# EAGLE design ELFKIN_TEST_B (EAGLE 7.7.0)
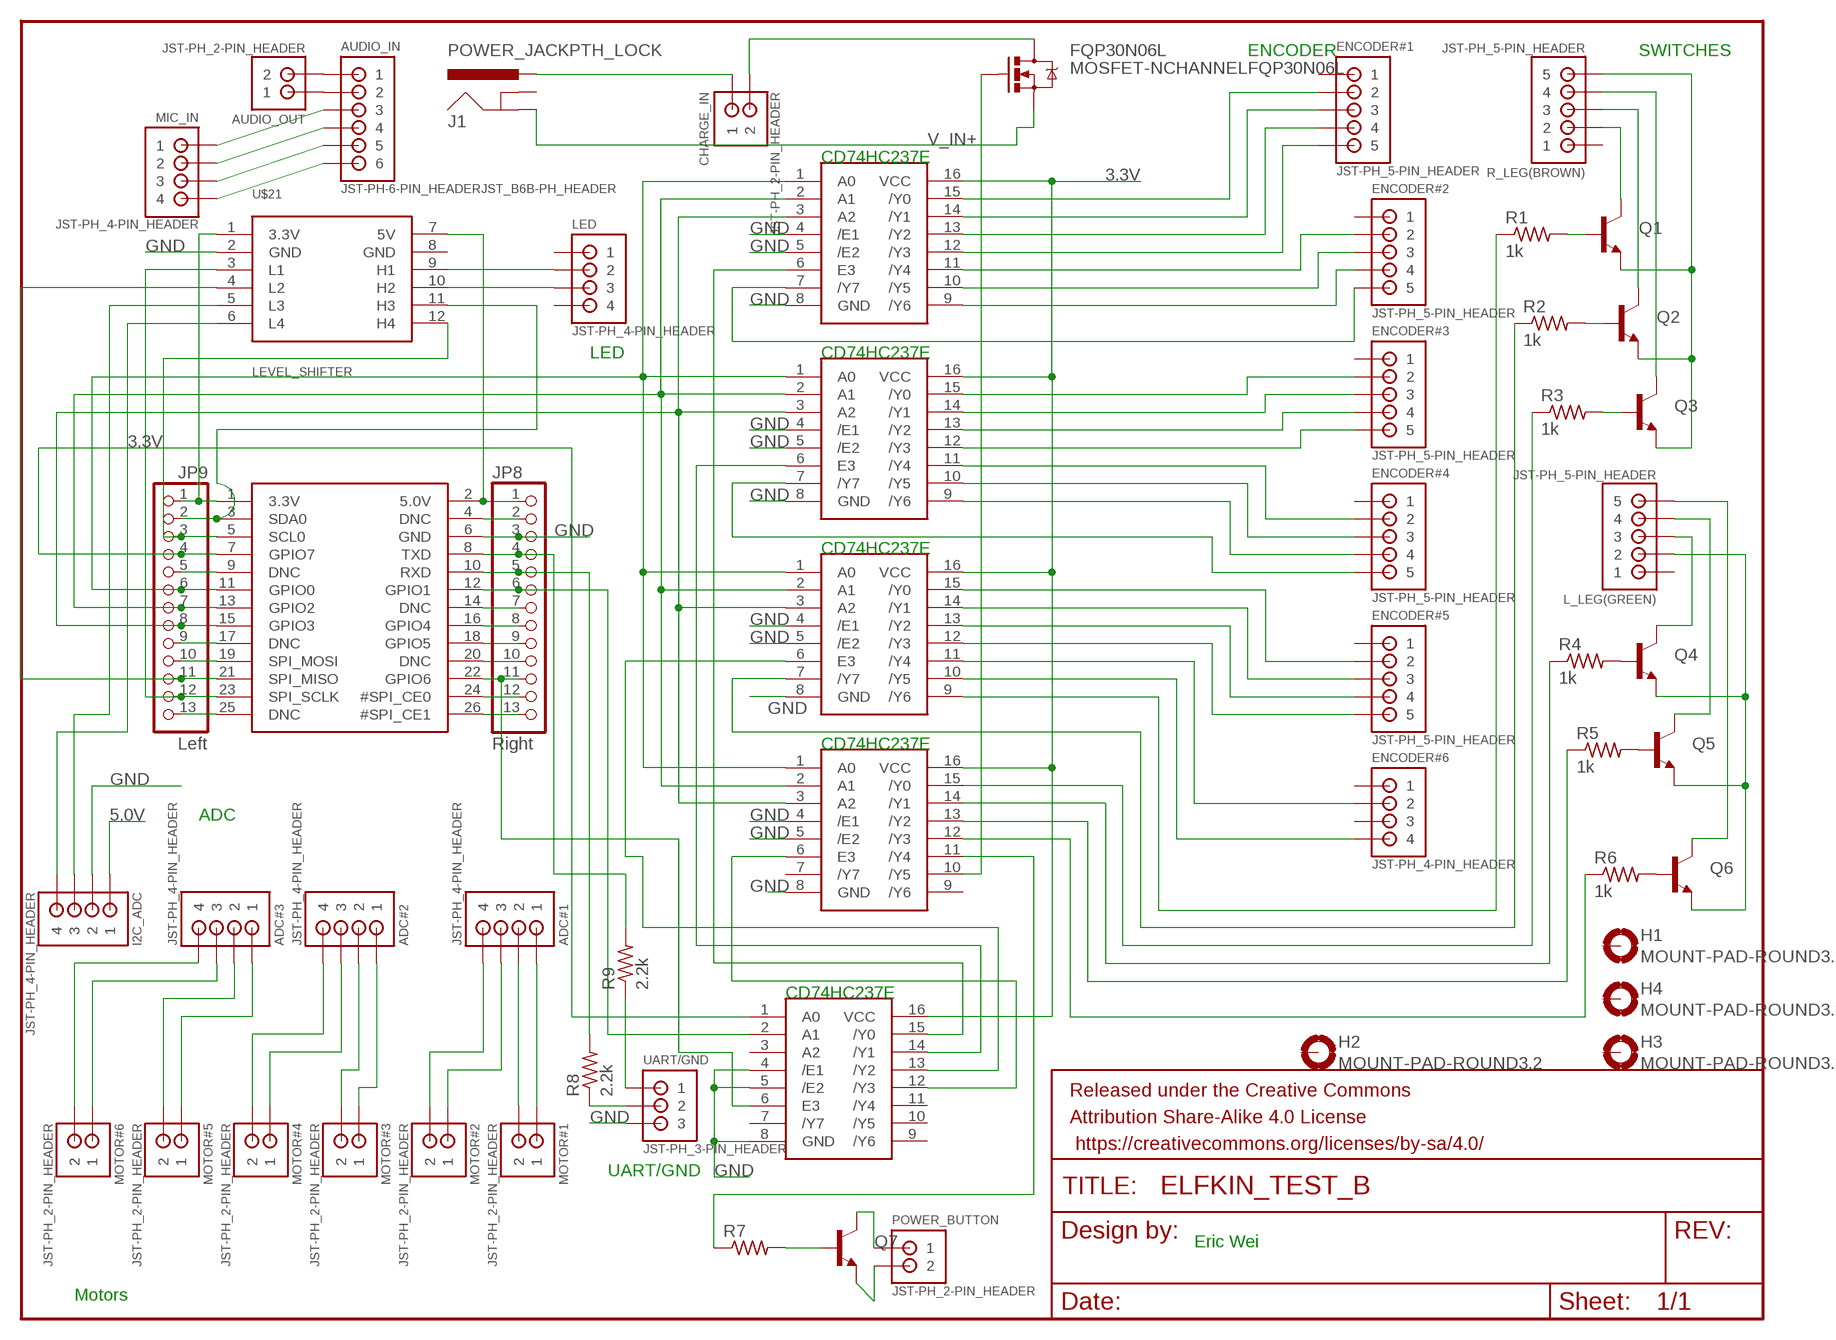
[diagram p0: schematic, sheet 1]

## Parts
ADC#1  JST-PH_4-PIN_HEADER  [JST_B4B-PH_HEADER]
ADC#2  JST-PH_4-PIN_HEADER  [JST_B4B-PH_HEADER]
ADC#3  JST-PH_4-PIN_HEADER  [JST_B4B-PH_HEADER]
AUDIO_IN  JST-PH-6-PIN_HEADERJST_B6B-PH_HEADER  [JST_B6B-PH_HEADER]
AUDIO_OUT  JST-PH_2-PIN_HEADER  [JST_B2B-PH_HEADER]
CHARGE_IN  JST-PH_2-PIN_HEADER  [JST_B2B-PH_HEADER]
ENCODER#1  JST-PH_5-PIN_HEADER  [JST_B5B-PH_HEADER]
ENCODER#2  JST-PH_5-PIN_HEADER  [JST_B5B-PH_HEADER]
ENCODER#3  JST-PH_5-PIN_HEADER  [JST_B5B-PH_HEADER]
ENCODER#4  JST-PH_5-PIN_HEADER  [JST_B5B-PH_HEADER]
ENCODER#5  JST-PH_5-PIN_HEADER  [JST_B5B-PH_HEADER]
ENCODER#6  JST-PH_4-PIN_HEADER  [JST_B4B-PH_HEADER]
FQP30N06L  MOSFET-NCHANNELFQP30N06L  [TO220V]
FRAME1  FRAME-LETTER  [CREATIVE_COMMONS]
H1  MOUNT-PAD-ROUND3.2  [3,2-PAD]
H2  MOUNT-PAD-ROUND3.2  [3,2-PAD]
H3  MOUNT-PAD-ROUND3.2  [3,2-PAD]
H4  MOUNT-PAD-ROUND3.2  [3,2-PAD]
I2C_ADC  JST-PH_4-PIN_HEADER  [JST_B4B-PH_HEADER]
J1  POWER_JACKPTH_LOCK  [POWER_JACK_PTH_LOCK]
JP7  PI  RASBERRYPI_IDC  [RASBERRYPI_IDC]
JP8  Right  HEADER-1X1380MIL  [1X13_ROUND_76MIL]
JP9  Left  HEADER-1X1380MIL  [1X13_ROUND_76MIL]
L_LEG(GREEN)  JST-PH_5-PIN_HEADER  [JST_B5B-PH_HEADER]
LED  JST-PH_4-PIN_HEADER  [JST_B4B-PH_HEADER]
MIC_IN  JST-PH_4-PIN_HEADER  [JST_B4B-PH_HEADER]
MOTOR#1  JST-PH_2-PIN_HEADER  [JST_B2B-PH_HEADER]
MOTOR#2  JST-PH_2-PIN_HEADER  [JST_B2B-PH_HEADER]
MOTOR#3  JST-PH_2-PIN_HEADER  [JST_B2B-PH_HEADER]
MOTOR#4  JST-PH_2-PIN_HEADER  [JST_B2B-PH_HEADER]
MOTOR#5  JST-PH_2-PIN_HEADER  [JST_B2B-PH_HEADER]
MOTOR#6  JST-PH_2-PIN_HEADER  [JST_B2B-PH_HEADER]
POWER_BUTTON  JST-PH_2-PIN_HEADER  [JST_B2B-PH_HEADER]
Q1  TRANSISTOR_NPN2N3904  [TO-92]
Q2  TRANSISTOR_NPN2N3904  [TO-92]
Q3  TRANSISTOR_NPN2N3904  [TO-92]
Q4  TRANSISTOR_NPN2N3904  [TO-92]
Q5  TRANSISTOR_NPN2N3904  [TO-92]
Q6  TRANSISTOR_NPN2N3904  [TO-92]
Q7  TRANSISTOR_NPN2N3904  [TO-92]
R1  1k  R-US_0207/5V  [0207/5V]
R2  1k  R-US_0207/5V  [0207/5V]
R3  1k  R-US_0207/5V  [0207/5V]
R4  1k  R-US_0207/5V  [0207/5V]
R5  1k  R-US_0207/5V  [0207/5V]
R6  1k  R-US_0207/5V  [0207/5V]
R7  R-US_0207/5V  [0207/5V]
R8  2.2k  R-US_0207/5V  [0207/5V]
R9  2.2k  R-US_0207/5V  [0207/5V]
R_LEG(BROWN)  JST-PH_5-PIN_HEADER  [JST_B5B-PH_HEADER]
U$1  74LVC138ADDIL16  [DIL16]
U$2  74LVC138ADDIL16  [DIL16]
U$3  74LVC138ADDIL16  [DIL16]
U$4  74LVC138ADDIL16  [DIL16]
U$5  74LVC138ADDIL16  [DIL16]
U$21  LEVEL_SHIFTER  [LEVEL_SHIFTER]
UART/GND  JST-PH_3-PIN_HEADER  [JST_B3B-PH_HEADER]

## Nets
3.3V: JP7.1(3.3V) JP9.1 U$1.16(VCC) U$2.16(VCC) U$3.16(VCC) U$4.16(VCC) U$5.16(VCC) U$21.1(3.3V)
5.0V: I2C_ADC.P1 JP7.2(5.0V) JP8.1 U$21.7(5V)
GND: I2C_ADC.P2 JP7.6(GND) JP8.3 U$1.4(/E1) U$1.5(/E2) U$1.8(GND) U$2.4(/E1) U$2.5(/E2) U$2.8(GND) U$3.4(/E1) U$3.5(/E2) U$3.8(GND) U$4.4(/E1) U$4.5(/E2) U$4.8(GND) U$5.4(/E1) U$5.5(/E2) U$5.8(GND) U$21.2(GND) UART/GND.P3
N$1: JP7.11(GPIO0) JP9.6 U$1.1(A0) U$2.1(A0) U$3.1(A0) U$4.1(A0)
N$2: JP7.13(GPIO2) JP9.7 U$1.2(A1) U$2.2(A1) U$3.2(A1) U$4.2(A1)
N$3: JP7.15(GPIO3) JP9.8 U$1.3(A2) U$2.3(A2) U$3.3(A2) U$4.3(A2)
N$4: ENCODER#1.P2 U$1.15(/Y0)
N$5: ENCODER#1.P3 U$1.14(/Y1)
N$6: ENCODER#1.P4 U$1.13(/Y2)
N$7: ENCODER#1.P5 U$1.12(/Y3)
N$8: ENCODER#2.P2 U$1.11(/Y4)
N$9: ENCODER#2.P3 U$1.10(/Y5)
N$10: ENCODER#2.P4 U$1.9(/Y6)
N$11: ENCODER#2.P5 U$1.7(/Y7)
N$12: ENCODER#3.P2 U$2.15(/Y0)
N$13: ENCODER#3.P3 U$2.14(/Y1)
N$14: ENCODER#3.P4 U$2.13(/Y2)
N$15: ENCODER#3.P5 U$2.12(/Y3)
N$16: ENCODER#4.P2 U$2.11(/Y4)
N$17: ENCODER#4.P3 U$2.10(/Y5)
N$18: ENCODER#4.P4 U$2.9(/Y6)
N$19: ENCODER#4.P5 U$2.7(/Y7)
N$20: ENCODER#5.P2 U$3.15(/Y0)
N$21: ENCODER#5.P3 U$3.14(/Y1)
N$22: ENCODER#5.P4 U$3.13(/Y2)
N$23: ENCODER#5.P5 U$3.12(/Y3)
N$24: ENCODER#6.P2 U$3.11(/Y4)
N$25: ENCODER#6.P4 U$3.10(/Y5)
N$26: R2.1 U$3.7(/Y7)
N$27: ADC#1.P1 MOTOR#1.P1
N$28: ADC#1.P2 MOTOR#1.P2
N$29: ADC#1.P3 MOTOR#2.P1
N$30: ADC#1.P4 MOTOR#2.P2
N$31: ADC#2.P1 MOTOR#3.P1
N$32: ADC#2.P2 MOTOR#3.P2
N$33: ADC#2.P3 MOTOR#4.P1
N$34: ADC#2.P4 MOTOR#4.P2
N$35: ADC#3.P1 MOTOR#5.P1
N$36: ADC#3.P2 MOTOR#5.P2
N$37: ADC#3.P3 MOTOR#6.P1
N$38: ADC#3.P4 MOTOR#6.P2
N$39: Q1.2(B) R1.2
N$40: Q3.2(B) R3.2
N$41: Q2.2(B) R2.2
N$42: Q4.2(B) R4.2
N$43: Q5.2(B) R5.2
N$44: Q6.2(B) R6.2
N$45: R1.1 U$3.9(/Y6)
N$46: R3.1 U$4.15(/Y0)
N$47: R4.1 U$4.14(/Y1)
N$48: R5.1 U$4.13(/Y2)
N$49: Q1.1(E) Q2.1(E) Q3.1(E) R_LEG(BROWN).P5
N$50: R6.1 U$4.12(/Y3)
N$51: AUDIO_IN.P3 MIC_IN.P1
N$52: I2C_ADC.P4 U$21.6(L4)
N$53: JP7.7(GPIO7) JP9.4 U$5.1(A0)
N$54: JP7.9(DNC) JP9.5
N$55: L_LEG(GREEN).P2 Q4.1(E) Q5.1(E) Q6.1(E)
N$56: L_LEG(GREEN).P3 Q4.3(C)
N$57: Q1.3(C) R_LEG(BROWN).P2
N$58: JP7.17(DNC) JP9.9
N$59: JP7.19(SPI_MOSI) JP9.10
N$60: JP7.18(GPIO5) JP8.9
N$61: JP7.23(SPI_SCLK) JP9.12 U$21.3(L1)
N$62: JP7.25(DNC) JP9.13
N$63: JP7.4(DNC) JP8.2
N$64: Q2.3(C) R_LEG(BROWN).P3
N$65: JP7.10(RXD) JP8.5 R8.2
N$66: JP7.12(GPIO1) JP8.6 U$5.2(A1)
N$67: JP7.14(DNC) JP8.7
N$68: JP7.16(GPIO4) JP8.8
N$70: JP7.20(DNC) JP8.10
N$71: JP7.22(GPIO6) JP8.11 U$5.6(E3)
N$72: JP7.24(#SPI_CE0) JP8.12
N$73: JP7.26(#SPI_CE1) JP8.13
N$74: L_LEG(GREEN).P4 Q5.3(C)
N$75: L_LEG(GREEN).P5 Q6.3(C)
N$76: I2C_ADC.P3 U$21.5(L3)
N$77: AUDIO_IN.P4 MIC_IN.P2
N$78: Q7.2(B) R7.2
N$79: POWER_BUTTON.P1 Q7.3(C)
N$80: POWER_BUTTON.P2 Q7.1(E)
N$81: R7.1 U$4.11(/Y4)
N$83: CHARGE_IN.P1 J1.PWR
N$84: FQP30N06L.1(G) U$4.10(/Y5)
N$85: AUDIO_IN.P2 AUDIO_OUT.P1
N$86: AUDIO_IN.P1 AUDIO_OUT.P2
N$87: U$1.6(E3) U$5.15(/Y0)
N$88: U$2.6(E3) U$5.14(/Y1)
N$89: U$3.6(E3) U$5.13(/Y2)
N$90: Q3.3(C) R_LEG(BROWN).P4
N$91: U$4.6(E3) U$5.12(/Y3)
N$92: JP7.8(TXD) JP8.4 R9.2
N$93: AUDIO_IN.P5 MIC_IN.P3
N$94: AUDIO_IN.P6 MIC_IN.P4
N$95: LED.P2 U$21.9(H1)
N$96: LED.P3 U$21.10(H2)
N$97: R8.1 UART/GND.P2
N$98: R9.1 UART/GND.P1
N$99: CHARGE_IN.P2 FQP30N06L.2(D)
N$100: JP7.21(SPI_MISO) JP9.11 U$21.4(L2)
N$101: JP7.5(SCL0) JP9.3 U$21.12(H4)
N$103: JP7.3(SDA0) JP9.2 U$21.11(H3)
V_IN+: FQP30N06L.3(S) J1.GND
Unconnected: ENCODER#1.P1 ENCODER#2.P1 ENCODER#3.P1 ENCODER#4.P1 ENCODER#5.P1 ENCODER#6.P1 ENCODER#6.P3 H1.B3,2(MOUNT) H2.B3,2(MOUNT) H3.B3,2(MOUNT) H4.B3,2(MOUNT) J1.GNDBREAK L_LEG(GREEN).P1 LED.P1 LED.P4 R_LEG(BROWN).P1 U$4.7(/Y7) U$4.9(/Y6) U$5.3(A2) U$5.7(/Y7) U$5.9(/Y6) U$5.10(/Y5) U$5.11(/Y4)

## Notes on the sheet
- ENCODER | SWITCHES
- CD74HC237E
- LED | CD74HC237E
- CD74HC237E
- CD74HC237E
- ADC
- CD74HC237E
- UART/GND
- Eric Wei
- Motors

## Power pins joined to a net without a drawn wire
GND: U$21.8(GND)

## Library data of the parts
ADC#1-ADC#3 ENCODER#6 I2C_ADC LED MIC_IN = SRG:JST-PH_4-PIN_HEADER: 4-pin JST PH Shrouded Header, top entry P/N B4B-PH-K-S Mating connector PHR-4 Mating cable assembly: Sparkfun PRT-09916 <http://www.sparkfun.com/products/9916>
AUDIO_IN = JST_Connectors:JST-PH-6-PIN_HEADER: 6-PIN JST PH Shrouded Header
AUDIO_OUT CHARGE_IN MOTOR#1-MOTOR#6 POWER_BUTTON = SRG:JST-PH_2-PIN_HEADER: 2-pin JST PH Shrouded Header, top entry P/N B2B-PH-K-S Mating connector PHR-2 Mating cable assembly: Sparkfun PRT-09914 <http://www.sparkfun.com/products/9914>
ENCODER#1-ENCODER#5 L_LEG(GREEN) R_LEG(BROWN) = SRG:JST-PH_5-PIN_HEADER: 5-pin JST PH Shrouded Header, top entry P/N B5B-PH-K-S Mating connector PHR-5 Mating cable assembly: Sparkfun PRT-09917 <http://www.sparkfun.com/products/9917>
FQP30N06L = SparkFun-DiscreteSemi:MOSFET-NCHANNEL: Common NMOSFET Parts MFG P/N Store ID Prod ID FDD8780 TRANS-09984 SI7820DN TRANS-11055 FDS6630A IC-08089 2N7002PW TRANS-11151 FQP30N06L COM-10213 TRANS-10060 BSS123LT1G TRANS-08345 BSS138 TRANS-00830 BS170 2N7000; PROD_ID: TRANS-10060
FRAME1 = SparkFun-Aesthetics:FRAME-LETTER: Schematic Frame Standard 8.5x11 US Letter frame
H1-H4 = holes:MOUNT-PAD-ROUND: MOUNTING PAD, round
J1 = SparkFun-Connectors:POWER_JACK: Power Jack This is the standard 5.5mm barrel jack for power. The PTH is the most common, proven, reliable, footprint. The Slot footprint only works if the mill layer is transmitted to the PCB fab house so be warned. Mating wall wart : TOL-00298 (and others); PROD_ID: CONN-08197; SF_ID: PRT-00119
JP7 = microbuilder:RASBERRYPI_IDC: Rasberry PI IDC Header
JP8 JP9 = microbuilder:HEADER-1X13
Q1-Q7 = SparkFun-DiscreteSemi:TRANSISTOR_NPN: Generic NPN BJT MMBT2222A - TRANS-08049 (SOT-23, 1A 40V) MPSA42 - TRANS-09116 (SOT-23, 500mA 300V) MMBT5088LT1G - TRANS-11160 (SOT-23, 50 mA 30V) BC547 - COM-08928 <http://www.sparkfun.com/products/8928> (TO-92 45V 100mA) (1.Collector 2.Base 3.Emitter) 2N3904 - COM-00521 <http://www.sparkfun.com/products/521> (TO-92 40V 200mA) (1.Emitter 2.Base 3.Collector) P2N2222A - COM-12852 <http://www.sparkfun.com/products/12852> (TO-92 40V 600mA) (1.Collector 2.Base 3.Emitter); PROD_ID: TRANS-08447
R1-R9 = resistor:R-US_: RESISTOR, American symbol
U$1-U$5 = SparkFun-DigitalIC:74LVC138AD: 3-to-8 decoder
U$21 = SparkFun-Connectors:LEVEL_SHIFTER
UART/GND = SRG:JST-PH_3-PIN_HEADER: 3-pin JST PH Shrouded Header, top entry P/N B3B-PH-K-S Mating connector PHR-3

## Net classes
0 default: clearance 0.205 mm

## Board
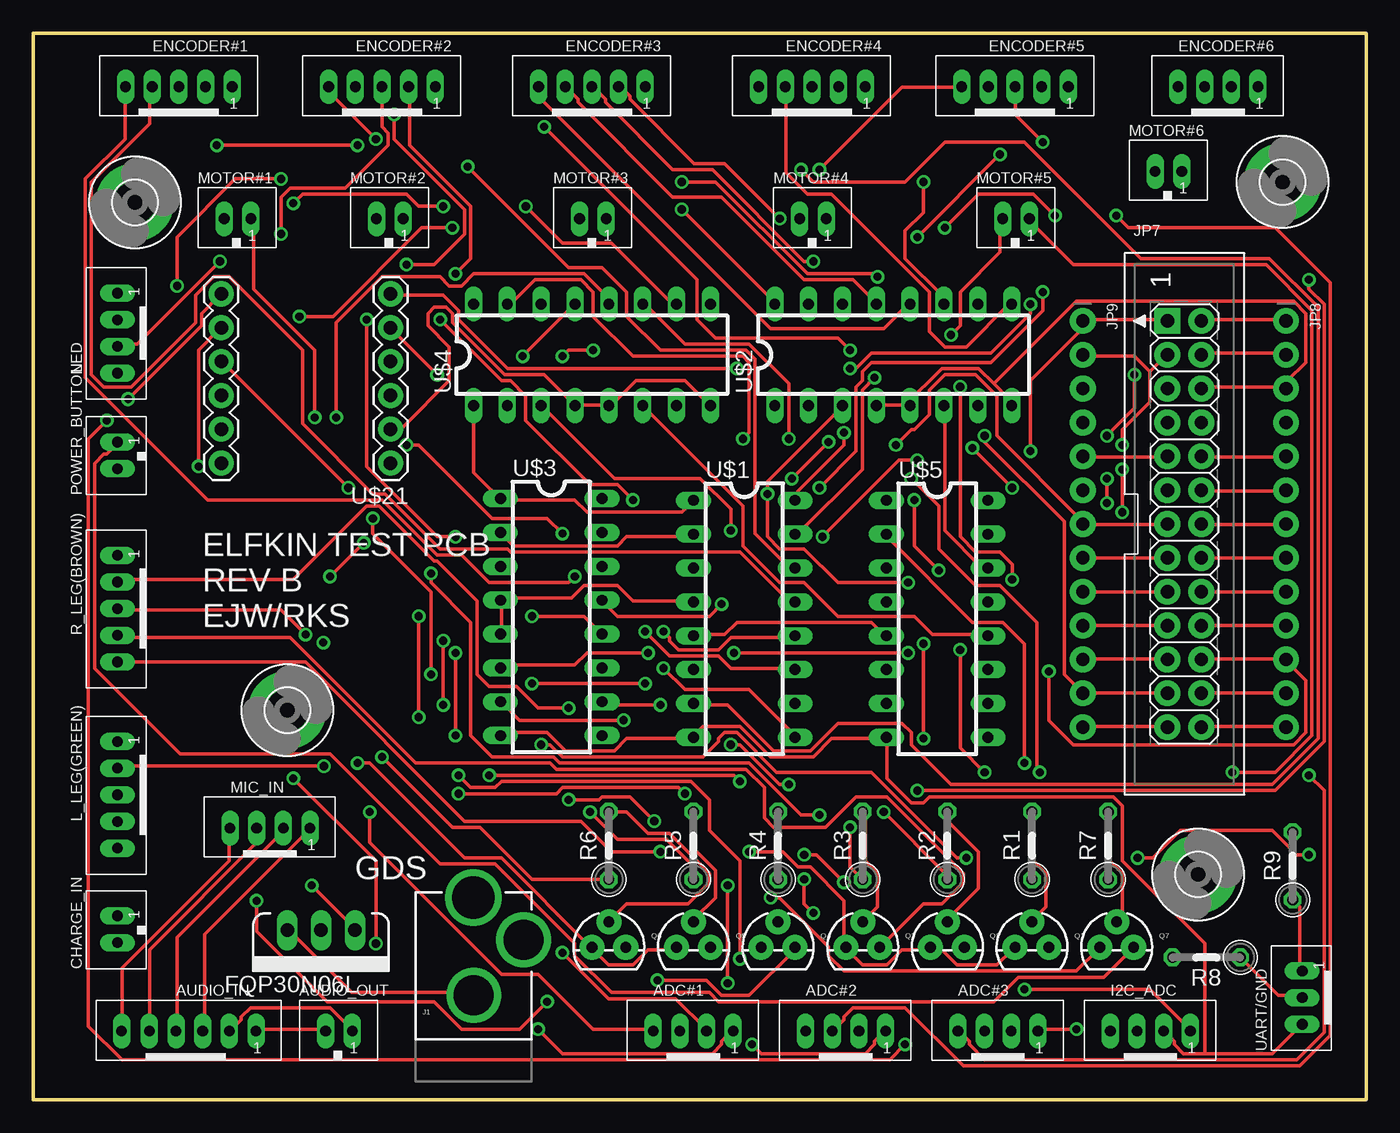
[diagram p1: board, top side]
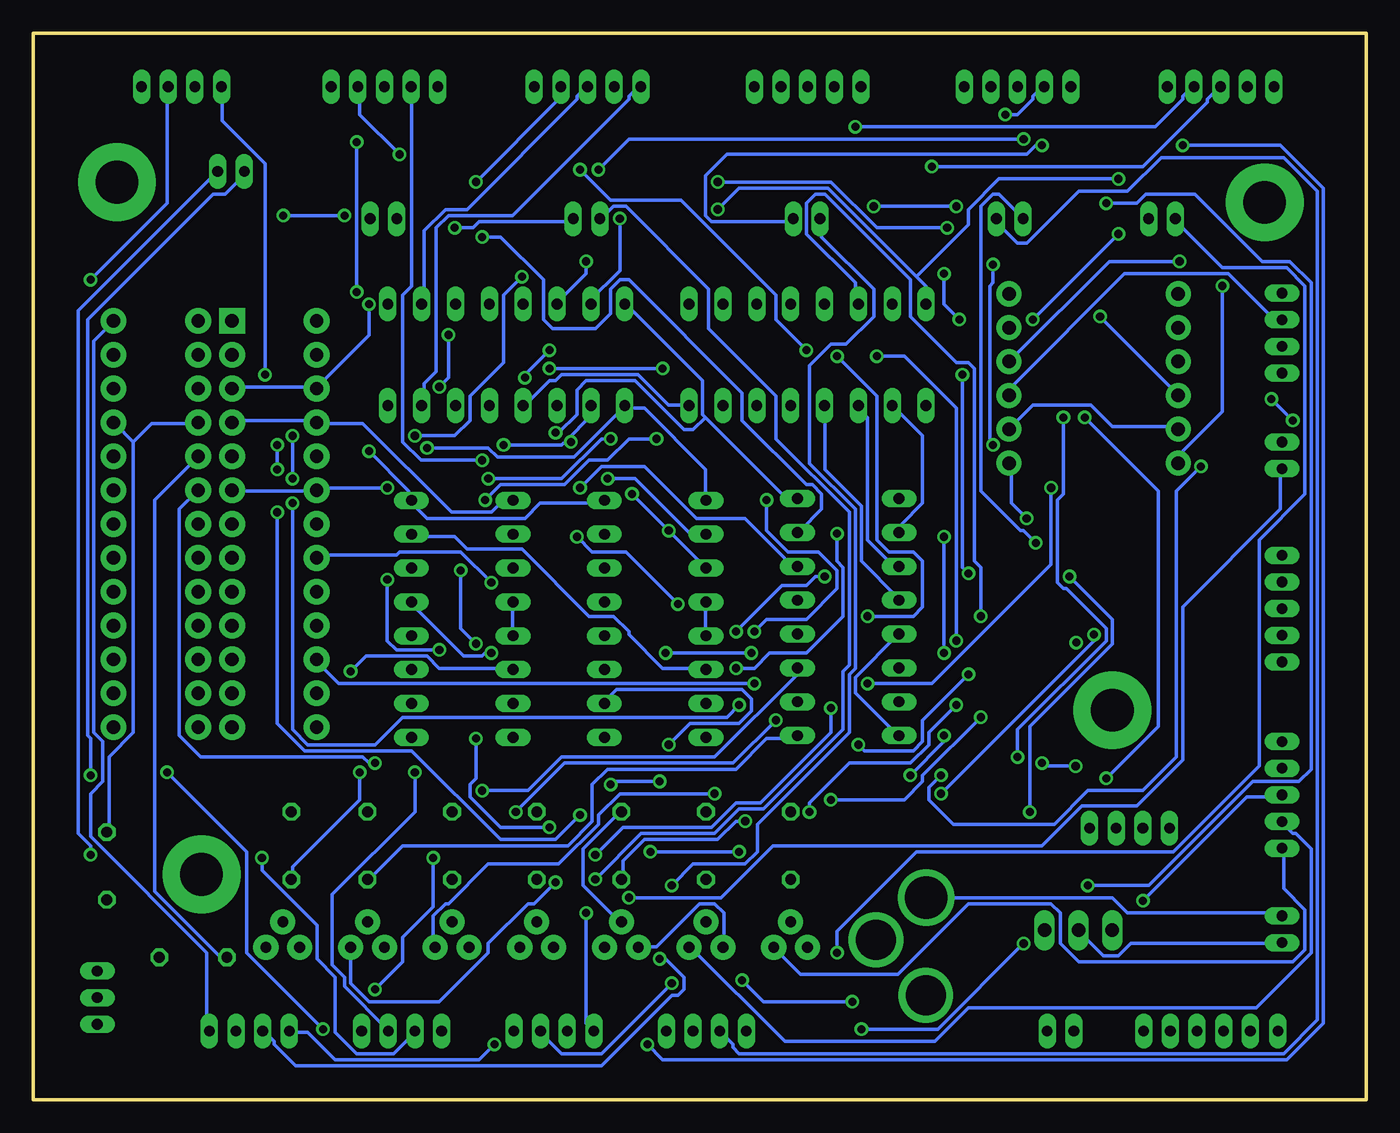
[diagram p2: board, bottom side, seen from below]

Size 100 x 80 mm. Coordinates in mm from the lower left corner, seen from the top.
Outline: 0,80 100,80 100,0 0,0 0,80
Copper layers (1*16): Top 0.035mm / dielectric 1.5mm / Bottom 0.035mm
Design rules "default *": minimum track width 10mil, minimum drill 24mil, track to track 8mil, track to pad 8mil, pad to pad 8mil, via to via 8mil, smd to smd 8mil, copper to edge 80mil, drill to drill 8mil, minimum pad ring 10mil, minimum via ring 8mil, stop-mask expansion 4mil, vias tented up to drill 0mil, thermal gap 10mil

### Footprints (pad centres in the part's own frame; a part is rotated, then mirrored left to right if it is on the bottom)
JST_B4B-PH_HEADER = drill 0.8 long: P1 2.98,0.048; P2 0.98,0.048; P3 -1.02,0.048; P4 -3.02,0.048
JST_B6B-PH_HEADER = drill 0.8 long: P1 4,0.048; P2 2,0.048; P3 0,0.048; P4 -2,0.048; P5 -4,0.048; P6 -6.076,0.048
JST_B2B-PH_HEADER = drill 0.8 long: P1 1.075,0.048; P2 -0.925,0.048
JST_B5B-PH_HEADER = drill 0.8 long: P1 4,0.048; P2 2,0.048; P3 0,0.048; P4 -2,0.048; P5 -4,0.048
TO220V = drill 1.016 long: 1 -2.54,0; 2 0,0; 3 2.54,0
3,2-PAD = drill 3.2 pad 5.842: B3,2 0,0
POWER_JACK_PTH_LOCK = drill 2.997 pad 4.115: GND 0.025,6.557; GNDBREAK 3.762,10.7 | drill 3.2 pad 4.115: PWR 0,13.878
RASBERRYPI_IDC = drill 1 pad 1.93 square: 1 -1.27,15.24 | drill 1 pad 1.93: 2 1.27,15.24; 3 -1.27,12.7; 4 1.27,12.7; 5 -1.27,10.16; 6 1.27,10.16; 7 -1.27,7.62; 8 1.27,7.62; 9 -1.27,5.08; 10 1.27,5.08; 11 -1.27,2.54; 12 1.27,2.54; 13 -1.27,0; 14 1.27,0; 15 -1.27,-2.54; 16 1.27,-2.54; 17 -1.27,-5.08; 18 1.27,-5.08; 19 -1.27,-7.62; 20 1.27,-7.62; 21 -1.27,-10.16; 22 1.27,-10.16; 23 -1.27,-12.7; 24 1.27,-12.7; 25 -1.27,-15.24; 26 1.27,-15.24
1X13_ROUND_76MIL = drill 1 pad 1.93: 1 -15.24,0; 2 -12.7,0; 3 -10.16,0; 4 -7.62,0; 5 -5.08,0; 6 -2.54,0; 7 0,0; 8 2.54,0; 9 5.08,0; 10 7.62,0; 11 10.16,0; 12 12.7,0; 13 15.24,0
TO-92 = drill 0.813 pad 1.88: 1 -1.27,0; 2 0,1.905; 3 1.27,0
0207/5V = drill 0.813 octagon: 1 -2.54,0; 2 2.54,0
DIL16 = drill 0.813 long: 1 -8.89,-3.81; 2 -6.35,-3.81; 3 -3.81,-3.81; 4 -1.27,-3.81; 5 1.27,-3.81; 6 3.81,-3.81; 7 6.35,-3.81; 8 8.89,-3.81; 9 8.89,3.81; 10 6.35,3.81; 11 3.81,3.81; 12 1.27,3.81; 13 -1.27,3.81; 14 -3.81,3.81; 15 -6.35,3.81; 16 -8.89,3.81
LEVEL_SHIFTER = drill 1.016 pad 1.88: 1 6.35,7.62; 2 6.35,5.08; 3 6.35,2.54; 4 6.35,0; 5 6.35,-2.54; 6 6.35,-5.08; 7 -6.35,7.62; 8 -6.35,5.08; 9 -6.35,2.54; 10 -6.35,0; 11 -6.35,-2.54; 12 -6.35,-5.08
JST_B3B-PH_HEADER = drill 0.8 long: P1 2.027,0.048; P2 0.028,0.048; P3 -1.972,0.048

### Placement (x,y rotation side)
ADC#1  49.53,5.08 0 top
ADC#2  60.96,5.08 0 top
ADC#3  72.39,5.08 0 top
AUDIO_IN  12.7,5.08 0 top
AUDIO_OUT  22.86,5.08 0 top
CHARGE_IN  6.35,12.7 90 top
ENCODER#1  10.92,75.95 0 top
ENCODER#2  26.16,75.95 0 top
ENCODER#3  41.91,75.95 0 top
ENCODER#4  58.42,75.95 0 top
ENCODER#5  73.66,75.95 0 top
ENCODER#6  88.9,75.95 0 top
FQP30N06L  21.59,12.7 180 top
FRAME1  -101.6,1.27 0 top  (outside the outline)
H1  19.05,29.21 0 top
H2  87.38,16.89 0 top
H3  7.62,67.31 0 top
H4  93.73,68.83 0 top
I2C_ADC  83.82,5.08 0 top
J1  33.02,1.27 0 top
JP7  86.36,43.18 0 top
JP8  93.98,43.18 270 top
JP9  78.74,43.18 270 top
L_LEG(GREEN)  6.35,22.86 90 top
LED  6.35,57.53 90 top
MIC_IN  17.78,20.32 0 top
MOTOR#1  15.24,66.04 0 top
MOTOR#2  26.67,66.04 0 top
MOTOR#3  41.91,66.04 0 top
MOTOR#4  58.42,66.04 0 top
MOTOR#5  73.66,66.04 0 top
MOTOR#6  85.09,69.6 0 top
POWER_BUTTON  6.35,48.26 90 top
Q1  74.93,11.43 0 top
Q2  68.58,11.43 0 top
Q3  62.23,11.43 0 top
Q4  55.88,11.43 0 top
Q5  49.53,11.43 0 top
Q6  43.18,11.43 0 top
Q7  81.28,11.43 0 top
R1  74.93,19.05 90 top
R2  68.58,19.05 90 top
R3  62.23,19.05 90 top
R4  55.88,19.05 90 top
R5  49.53,19.05 90 top
R6  43.18,19.05 90 top
R7  80.64,19.05 90 top
R8  88.01,10.67 180 top
R9  94.49,17.53 90 top
R_LEG(BROWN)  6.35,36.83 90 top
U$1  53.34,36.07 270 top
U$2  64.52,55.88 0 top
U$3  38.86,36.2 270 top
U$4  41.91,55.88 0 top
U$5  67.82,36.07 270 top
U$21  20.45,55.37 180 top
UART/GND  95.25,7.62 90 top

### Tracks (layer width: path | path; a pad name or v marks a point on that pad's centre or on a via)
3.3V  (via drill 0.61)
  Top 0.254: JP7.1 84.92,58.52 78.95,58.52 JP9.1 78.72,58.29 78.72,57.83 74.82,53.93 v74.82,48.65 | v48.65,66.78 55.54,59.9 U$2.16 | v10.79,61.05 10.79,64.72 15.15,69.08 v18.59,69.08 | v60.82,50.03 60.82,49.11 57.38,45.67 57.38,44.98 U$1.16
  Bottom 0.254: U$1.16 57.38,44.75 61.97,44.75 63.11,43.6 70.46,43.6 71.6,44.75 U$5.16 71.83,44.98 71.83,45.67 v74.82,48.65 | 33.74,61.74 40.39,68.39 47.05,68.39 v48.65,66.78 | 33.74,61.74 33.05,61.05 33.05,59.9 U$4.16 | 49.57,51.18 49.8,51.41 49.8,53.93 55.54,59.67 U$2.16 | 49.57,51.18 43.6,45.21 42.69,45.21 U$3.16 | v10.79,61.05 10.79,51.64 14,48.42 14,47.97 U$21.1 | v18.59,69.08 27.54,69.08 29.84,66.78 29.84,65.64 33.74,61.74 | v60.82,50.03 60.59,50.03 59.21,51.41 59.21,53.24 58.52,53.93 54.85,53.93 51.18,50.26 50.49,50.26 49.57,51.18
5.0V  (via drill 0.61)
  Top 0.254: v25.47,43.6 25.47,42.46 29.84,38.1 v29.84,31.9 | v38.1,26.62 38.78,26.62 39.7,25.7 50.26,25.7 51.41,26.85 51.41,27.08 51.87,27.54 52.78,27.54 55.77,24.56 62.88,24.56 69.31,18.13 v70,18.13 | v74.36,8.26 83.77,8.26 86.75,5.28 I2C_ADC.P1 | JP7.2 87.67,58.52 93.86,58.52 JP8.1
  Bottom 0.254: I2C_ADC.P1 86.98,5.28 86.98,11.02 95.7,19.74 95.7,22.95 94.78,23.87 94.78,26.85 95.47,27.54 95.47,56.92 94.09,58.29 JP8.1 | v25.47,43.6 26.62,44.75 26.62,47.74 U$21.7 | v29.84,31.9 33.28,28.46 33.28,26.85 33.97,26.16 37.64,26.16 v38.1,26.62 | v70,18.13 70,14.46 72.29,12.16 72.29,10.33 v74.36,8.26
GND
  Top 0.254: U$4.8 50.72,52.1 48.88,53.93 45.21,53.93 43.38,52.1 U$4.5 43.15,52.1 40.85,52.1 U$4.4 40.62,52.1 38.33,54.39 35.34,54.39 31.44,58.29 31.44,58.98 30.98,59.44 30.06,59.44 29.61,58.98 29.61,58.06 31.21,56.46 31.21,53.93 27.77,50.49 26.85,50.49 U$21.8 | JP7.6 87.67,53.47 93.86,53.47 JP8.3 94.09,53.47 94.09,53.93 95.47,55.31 95.47,58.98 94.55,59.9 78.26,59.9 72.06,53.7 | 65.41,52.1 65.64,52.1 U$2.5 65.41,52.1 | 65.41,52.1 63.34,52.1 U$2.4 | 72.06,53.7 70.92,54.85 68.16,54.85 65.41,52.1 | 72.06,53.7 73.21,52.56 73.21,52.1 U$2.8 | U$1.5 49.57,34.88 51.87,34.88 52.78,35.8 62.88,35.8 63.8,34.88 U$5.5 | 87.9,3.44 92.95,3.44 95.01,5.51 UART/GND.P3 | 87.9,3.44 86.29,3.44 85.6,4.13 85.6,4.36 84.92,5.05 I2C_ADC.P2 | U$3.5 35.11,35.11 35.11,37.41 U$3.4 35.11,37.64 40.39,37.64 41.31,38.56 43.83,38.56 44.98,37.41 49.34,37.41 U$1.4 | U$3.8 35.11,27.31 35.34,27.54 38.56,27.54 39.93,26.16 43.6,26.16 44.52,27.08 49.34,27.08 U$1.8 49.57,27.31 50.26,28 53.01,28 55.31,25.7 58.52,25.7 59.9,27.08 63.8,27.08 U$5.8 64.03,27.08 64.03,24.1 65.87,22.26 66.78,22.26 67.24,22.72 81.01,22.72 81.7,22.03 81.7,17.9 87.9,11.7 87.9,3.44
  Bottom 0.254: U$21.2 14.23,50.49 19.05,50.49 20.66,52.1 25.02,52.1 26.62,50.49 U$21.8 | U$4.8 50.95,52.1 52.33,52.1 54.62,54.39 60.36,54.39 60.82,53.93 61.28,53.93 63.11,52.1 U$2.4 | U$1.5 49.57,34.88 49.57,37.18 U$1.4 | U$5.5 64.03,34.88 64.03,37.18 U$5.4 | U$3.8 35.11,27.31 38.33,30.52 38.33,31.67 35.11,34.88 U$3.5 | U$4.4 40.62,51.87 40.62,47.28 37.87,44.52 37.87,40.39 35.11,37.64 U$3.4
N$1  (via drill 0.61)
  Top 0.254: U$4.1 33.05,51.87 33.05,47.05 34.88,45.21 U$3.1 35.11,44.98 40.62,44.98 41.54,44.06 48.65,44.06 49.34,44.75 U$1.1 | v70.46,48.88 v73.44,45.9
  Bottom 0.254: JP7.11 84.92,45.67 78.95,45.67 JP9.6 78.72,45.9 v73.44,45.9 | U$1.1 49.57,44.98 49.57,47.28 54.16,51.87 55.54,51.87 U$2.1 55.77,51.87 59.44,48.2 65.18,48.2 65.87,48.88 v70.46,48.88
N$2  (via drill 0.61)
  Top 0.254: U$1.2 49.34,42.23 44.52,42.23 43.83,41.54 36.03,41.54 35.11,42.46 U$3.2 | v64.72,49.11 65.87,50.26 66.1,50.26 67.24,51.41 67.24,53.24 68.39,54.39 70.69,54.39 72.29,52.78 72.29,49.8 78.72,43.38 JP9.7 78.95,43.15 84.92,43.15 JP7.13 | v59.67,49.34 v56.92,46.59
  Bottom 0.254: U$3.2 34.88,42.69 34.88,43.15 33.28,44.75 33.28,49.8 35.34,51.87 U$4.2 | 59.9,49.57 60.36,49.11 v64.72,49.11 | 59.9,49.57 58.29,51.18 58.29,51.87 U$2.2 | v56.92,46.59 54.85,46.59 50.72,42.46 49.57,42.46 U$1.2 | 59.9,49.57 v59.67,49.34
N$3  (via drill 0.61)
  Top 0.254: JP9.8 78.95,40.62 84.92,40.62 JP7.15 | U$2.3 60.59,51.87 55.08,46.36 v55.08,45.44 55.08,42.23 56,41.31 57.83,41.31 60.36,38.78 v65.64,38.78 | v52.33,42.69 52.33,44.29 50.03,46.59 43.6,46.59 38.33,51.87 U$4.3
  Bottom 0.254: U$3.3 35.11,40.16 35.57,40.16 37.41,42 37.41,51.18 38.1,51.87 U$4.3 | v55.08,45.44 v52.33,42.69 49.57,39.93 U$1.3 | v65.64,38.78 67.93,41.08 72.52,41.08 72.75,40.85 78.72,40.85 JP9.8
N$4  (via drill 0.61)
  Top 0.254: v38.33,72.98 49.8,61.51 49.8,58.52 51.18,57.15 60.36,57.15 v61.28,56.23 | v63.11,54.16 62.19,53.24 62.19,47.28 57.38,42.46 U$1.15
  Bottom 0.254: v38.33,72.98 15.84,72.98 13.77,75.05 13.77,75.28 13.08,75.97 ENCODER#1.P2 | v61.28,56.23 63.11,54.39 v63.11,54.16
N$5  (via drill 0.61)
  Top 0.254: v32.59,70 40.16,62.42 42.69,62.42 44.52,60.59 44.52,58.75 47.05,56.23 53.47,56.23 54.16,55.54 54.16,42.46 56.69,39.93 57.15,39.93 U$1.14
  Bottom 0.254: v32.59,70 16.75,70 11.93,74.82 11.93,75.05 11.02,75.97 ENCODER#1.P3
N$6
  Top 0.254: ENCODER#1.P4 8.72,75.97 8.72,73.21 4.36,68.85 4.36,54.39 5.28,53.47 7.34,53.47 12.16,58.29 12.16,60.36 13.54,61.74 14.69,61.74 20.2,56.23 20.2,50.72 25.47,45.44 26.39,45.44 30.52,41.31 35.57,41.31 35.8,41.08 53.01,41.08 56.69,37.41 57.15,37.41 U$1.13
N$7  (via drill 0.61)
  Top 0.254: v40.62,39.24 40.16,38.78 34.2,38.78 32.13,40.85 30.29,40.85 26.16,44.98 13.08,44.98 3.9,54.16 3.9,69.08 6.88,72.06 6.88,75.97 ENCODER#1.P5 | v47.28,35.11 47.74,34.65 47.74,34.42 48.42,33.74 51.41,33.74 52.33,34.65 57.15,34.65 U$1.12
  Bottom 0.254: v40.62,39.24 41.31,39.24 42,38.56 43.83,38.56 v47.28,35.11
N$8  (via drill 0.61)
  Top 0.254: v31.67,61.97 32.82,63.11 32.82,67.01 28.23,71.6 28.23,75.97 ENCODER#2.P2 | v30.52,58.52 35.11,53.93 35.8,53.93 36.95,52.78 36.95,50.95 41.77,46.13 43.83,46.13 v44.98,44.98 | v45.9,35.11 47.74,33.28 51.41,33.28 52.33,32.36 57.15,32.36 U$1.11
  Bottom 0.254: v31.67,61.97 31.67,59.67 v30.52,58.52 | v44.98,44.98 44.98,42.69 43.38,41.08 41.08,41.08 39.7,39.7 39.7,38.33 42,36.03 44.98,36.03 v45.9,35.11
N$9  (via drill 0.61)
  Top 0.254: v18.59,64.95 18.59,67.7 19.28,68.39 23.41,68.39 26.62,71.6 26.62,72.52 26.16,72.98 26.16,75.97 ENCODER#2.P3 | v25.02,58.52 25.02,47.51 30.29,42.23 v31.67,42.23 | v31.67,27.31 v31.67,33.51 | v34.2,24.33 52.56,24.33 v53.01,23.87 | v56.69,23.64 56,23.64 53.01,26.62 v52.33,26.62
  Bottom 0.254: v25.02,58.52 v18.59,64.95 | v31.67,33.51 v31.67,42.23 | v31.67,27.31 31.67,26.85 v34.2,24.33 | v53.01,23.87 56.46,23.87 v56.69,23.64 | v52.33,26.62 50.72,28.23 47.05,28.23 46.13,29.15 46.13,30.06 46.82,30.75 56.23,30.75 57.15,29.84 U$1.10
N$10  (via drill 0.61)
  Top 0.254: v27.08,73.9 27.08,72.06 32.36,66.78 32.36,64.95 30.06,62.65 v28,62.65 | v28,49.11 28.92,49.11 34.42,43.6 38.56,43.6 v39.7,42.46 | v47.28,32.36 48.88,30.75 53.7,30.75 57.15,27.31 U$1.9
  Bottom 0.254: v27.08,73.9 26.16,73.9 25.02,75.05 25.02,75.28 24.33,75.97 ENCODER#2.P4 | v28,62.65 28,61.28 28.23,61.05 28.23,49.34 v28,49.11 | v39.7,42.46 39.7,40.39 39.24,39.93 39.24,36.26 42,33.51 44.75,33.51 45.9,32.36 v47.28,32.36
N$11  (via drill 0.61)
  Top 0.254: v25.7,72.06 22.26,75.5 22.26,75.97 ENCODER#2.P5 | v57.6,69.77 58.52,68.85 65.41,68.85 68.39,71.83 74.36,71.83 83.08,63.11 92.72,63.11 96.39,59.44 96.39,27.08 92.95,23.64 68.85,23.64 65.87,26.62 65.87,27.54 65.18,28.23 60.36,28.23 58.29,26.16 55.54,26.16 52.1,29.61 49.57,29.61 U$1.7
  Bottom 0.254: v25.7,72.06 55.31,72.06 v57.6,69.77
N$12  (via drill 0.61)
  Top 0.254: v56,66.1 51.87,70.23 49.57,70.23 44.75,75.05 44.75,75.28 44.06,75.97 ENCODER#3.P2
  Bottom 0.254: v56,66.1 56,62.19 58.29,59.9 U$2.15
N$13  (via drill 0.61)
  Top 0.254: v58.52,62.88 57.83,62.88 50.95,69.77 47.97,69.77 42.92,74.82 42.92,75.05 42,75.97 ENCODER#3.P3
  Bottom 0.254: v58.52,62.88 58.52,61.97 60.59,59.9 U$2.14
N$14
  Top 0.254: ENCODER#3.P4 39.93,75.97 40.85,75.05 40.85,74.82 47.97,67.7 51.64,67.7 57.83,61.51 61.51,61.51 63.11,59.9 U$2.13
N$15
  Top 0.254: ENCODER#3.P5 38.1,75.97 38.1,75.05 55.31,57.83 63.8,57.83 65.64,59.67 U$2.12
N$16  (via drill 0.61)
  Top 0.254: v66.78,68.85 66.78,66.56 65.41,65.18 65.41,63.11 68.16,60.36 68.16,59.9 U$2.11
  Bottom 0.254: v66.78,68.85 60.59,75.05 60.59,75.97 ENCODER#4.P2
N$17
  Bottom 0.254: ENCODER#4.P3 58.52,75.97 59.21,75.28 59.21,75.05 67.47,66.78 69.08,66.78 70.69,65.18 70.69,59.9 U$2.10
N$18
  Top 0.254: ENCODER#4.P4 56.46,75.97 56.46,69.54 58.06,67.93 59.9,67.93 67.24,60.59 67.24,57.6 68.39,56.46 70,56.46 73.21,59.67 U$2.9
N$19
  Bottom 0.254: ENCODER#4.P5 54.62,75.97 55.31,75.28 55.31,75.05 64.03,66.33 68.85,66.33 69.77,65.41 69.77,54.62 70.69,53.7 70.69,52.1 U$2.7
N$20  (via drill 0.61)
  Top 0.254: v66.33,64.72 v72.52,70.92
  Bottom 0.254: v72.52,70.92 75.5,73.9 75.5,75.97 ENCODER#5.P2 | v66.33,64.72 64.95,64.72 61.74,61.51 61.74,58.52 61.05,57.83 57.83,57.83 56.69,58.98 56.69,60.82 56,61.51 55.31,61.51 46.82,53.01 46.82,50.95 42,46.13 41.54,46.13 40.85,45.44 40.85,44.29 42.46,42.69 U$3.15
N$21  (via drill 0.61)
  Top 0.254: v75.73,71.83 73.67,73.9 73.67,75.97 ENCODER#5.P3 | v75.73,60.59 75.73,59.21 71.83,55.31 62.88,55.31 62.19,54.62 62.19,53.93 61.74,53.47 61.74,48.65 v58.98,45.9
  Bottom 0.254: v75.73,60.59 v75.73,71.83 | v58.98,45.9 57.38,47.51 54.16,47.51 50.26,43.6 46.59,43.6 43.15,40.16 42.69,40.16 U$3.14
N$22  (via drill 0.61)
  Top 0.254: v66.33,47.97 64.95,47.97 v59.21,42.23 | v51.64,37.18 50.72,36.26 43.83,36.26 42.69,37.41 U$3.13
  Bottom 0.254: v66.33,47.97 70.92,47.97 72.29,49.34 72.29,60.36 71.6,61.05 71.6,75.97 ENCODER#5.P4 | v59.21,42.23 58.06,41.08 55.54,41.08 v51.64,37.18
N$23  (via drill 0.61)
  Top 0.254: v58.98,69.77 65.18,75.97 69.54,75.97 ENCODER#5.P5 | v42,56.23 40.16,56.23 v39.7,55.77 | v37.41,36.26 41.31,36.26 42.46,35.11 U$3.12
  Bottom 0.254: v58.98,69.77 56.69,67.47 51.41,67.47 44.29,60.36 44.29,58.52 v42,56.23 | v39.7,55.77 36.72,52.78 36.72,42 35.8,41.08 33.97,41.08 33.28,40.39 33.28,36.95 33.97,36.26 v37.41,36.26
N$24  (via drill 0.61)
  Top 0.254: v95.7,61.51 95.7,60.82 96.85,59.67 96.85,26.85 93.18,23.18 v66.33,23.18
  Bottom 0.254: v95.7,61.51 89.96,67.24 89.96,75.97 ENCODER#6.P2 | v66.33,23.18 62.88,23.18 60.36,25.7 48.88,25.7 42.69,31.9 42.69,32.36 U$3.11
N$25  (via drill 0.61)
  Top 0.254: v82.62,54.39 82.62,51.87 v80.56,49.8 | v80.56,44.75 v80.56,46.59 | v47.05,29.61 42.92,29.61 42.69,29.84 U$3.10
  Bottom 0.254: v82.62,54.39 82.62,70.23 85.83,73.44 85.83,75.97 ENCODER#6.P4 | v80.56,46.59 v80.56,49.8 | v80.56,44.75 80.56,27.77 79.41,26.62 74.36,26.62 72.29,28.69 47.97,28.69 v47.05,29.61
N$26  (via drill 0.61)
  Top 0.254: v63.8,21.57 68.39,16.98 68.39,16.52 R2.1 | v44.29,28.46 36.49,28.46 35.11,29.84 U$3.7
  Bottom 0.254: v63.8,21.57 60.13,25.25 47.51,25.25 v44.29,28.46
N$27  (via drill 0.61)
  Top 0.254: v37.87,5.28 39.7,3.44 50.95,3.44 51.64,4.13 51.64,4.36 52.33,5.05 ADC#1.P1 | v25.7,11.7 25.7,17.9 v19.51,24.1 | v21.11,51.18 21.11,56.23 16.52,60.82 16.52,65.87 MOTOR#1.P1
  Bottom 0.254: v37.87,5.28 32.13,5.28 v25.7,11.7 | v19.51,24.1 15.61,28 15.61,45.67 v21.11,51.18
N$28  (via drill 0.61)
  Top 0.254: v39.7,11.02 43.15,7.57 48.2,7.57 50.49,5.28 ADC#1.P2
  Bottom 0.254: v39.7,11.02 39.7,12.62 33.74,18.59 14.46,18.59 8.03,25.02 8.03,42 4.59,45.44 4.59,61.05 5.97,62.42 10.79,62.42 14.23,65.87 MOTOR#1.P2
N$29
  Bottom 0.254: ADC#1.P3 48.42,5.05 47.51,4.13 47.51,3.9 47.05,3.44 6.2,3.44 3.67,5.97 3.67,68.16 6.2,70.69 15.38,70.69 17.9,68.16 21.57,68.16 25.47,64.26 26.16,64.26 27.77,65.87 MOTOR#2.P1
N$30  (via drill 0.61)
  Top 0.254: v25.25,21.57 25.25,19.28 35.11,9.41 37.87,9.41 42,5.28 46.36,5.28 ADC#1.P4 | v24.79,41.77 v22.26,39.24
  Bottom 0.254: v25.25,21.57 25.25,28 19.05,34.2 19.05,36.03 v22.26,39.24 | v24.79,41.77 25.7,42.69 25.93,42.69 28.92,45.67 28.92,67.01 28,67.93 27.54,67.93 25.7,66.1 MOTOR#2.P2
N$31  (via drill 0.61)
  Top 0.254: v53.93,4.13 54.62,3.44 62.42,3.44 63.11,4.13 63.11,4.36 63.8,5.05 ADC#2.P1 | v24.33,71.6 v13.77,71.6
  Bottom 0.254: v53.93,4.13 52.78,2.98 5.97,2.98 3.21,5.74 3.21,68.39 6.43,71.6 v13.77,71.6 | v24.33,71.6 24.79,71.6 25.47,70.92 47.97,70.92 49.57,69.31 49.57,66.33 49.11,65.87 43.15,65.87 MOTOR#3.P1
N$32  (via drill 0.61)
  Top 0.254: v52.1,8.72 v52.1,16.07
  Bottom 0.254: v52.1,16.07 50.49,17.67 46.59,17.67 45.67,18.59 45.67,20.66 38.78,27.54 38.78,31.9 38.33,32.36 38.33,44.29 41.77,47.74 41.77,55.08 40.16,56.69 39.02,56.69 36.95,58.75 36.95,60.82 40.85,64.72 40.85,65.87 MOTOR#3.P2 | v52.1,8.72 57.38,3.44 60.36,3.44 61.97,5.05 ADC#2.P2
N$33  (via drill 0.61)
  Top 0.254: v81.24,66.33 82.16,65.41 93.18,65.41 97.31,61.28 97.31,4.82 95.01,2.52 69.77,2.52 65.41,6.88 61.51,6.88 60.82,6.2 60.82,5.97 60.13,5.28 ADC#2.P3 | v76.65,66.33 75.05,67.93 70.92,67.93 v68.39,65.41
  Bottom 0.254: v76.65,66.33 v81.24,66.33 | v68.39,65.41 67.01,65.41 66.56,65.87 59.67,65.87 MOTOR#4.P1
N$34  (via drill 0.61)
  Top 0.254: v57.83,16.52 57.83,14.69 v58.52,14
  Bottom 0.254: v57.83,16.52 54.39,19.97 48.88,19.97 47.05,21.8 45.21,21.8 39.24,27.77 39.24,32.13 38.78,32.59 38.78,44.06 44.29,49.57 44.29,52.78 49.34,57.83 49.34,60.82 55.54,67.01 56.46,67.01 57.38,66.1 MOTOR#4.P2 | v58.52,14 58.52,5.74 58.06,5.28 ADC#2.P4
N$35  (via drill 0.61)
  Top 0.254: v78.26,5.28 75.5,5.28 ADC#3.P1 | v89.96,24.56 93.18,24.56 95.93,27.31 95.93,59.21 92.49,62.65 78.03,62.65 74.82,65.87 MOTOR#5.P1
  Bottom 0.254: v78.26,5.28 84,11.02 84,18.59 v89.96,24.56
N$36  (via drill 0.61)
  Top 0.254: v68.85,57.38 69.54,58.06 69.54,60.59 72.52,63.57 72.52,65.87 MOTOR#5.P2 | v69.54,53.47 69.54,42.23 70.69,41.08 72.52,41.08 73.44,40.16 v73.44,39.02 | v69.54,33.74 69.54,26.39 v71.37,24.56
  Bottom 0.254: v68.85,57.38 68.85,54.16 v69.54,53.47 | v73.44,39.02 73.44,34.42 72.75,33.74 v69.54,33.74 | v71.37,24.56 71.37,21.57 77.57,15.38 77.57,10.1 76.65,9.18 76.65,8.49 73.44,5.28 ADC#3.P2
N$37  (via drill 0.61)
  Top 0.254: v82.85,18.13 84,18.13 86.06,20.2 92.95,20.2 94.78,18.36 v95.7,18.36
  Bottom 0.254: v82.85,18.13 82.85,17.21 78.72,13.08 78.72,10.56 77.34,9.18 77.34,5.05 75.73,3.44 72.98,3.44 71.37,5.05 ADC#3.P3 | v95.7,18.36 95.7,19.05 96.62,19.97 96.62,59.21 86.29,69.54 MOTOR#6.P1
N$38  (via drill 0.61)
  Top 0.254: v95.7,24.33 96.85,23.18 96.85,5.05 94.78,2.98 71.37,2.98 70.23,4.13 70.23,4.36 69.54,5.05 ADC#3.P4
  Bottom 0.254: v95.7,24.33 95.7,27.08 95.93,27.31 95.93,58.52 86.52,67.93 85.6,67.93 84,69.54 MOTOR#6.P2
N$39
  Top 0.254: R1.2 75.05,21.57 75.05,17.9 75.97,16.98 75.97,14.46 75.05,13.54 Q1.2
N$40
  Top 0.254: R3.2 62.42,21.57 62.42,17.9 63.34,16.98 63.34,14.46 62.42,13.54 Q3.2
N$41
  Top 0.254: R2.2 68.62,21.57 68.62,20.88 70.92,18.59 70.92,15.84 68.62,13.54 Q2.2
N$42
  Bottom 0.254: R4.2 56,21.57 58.75,18.82 58.75,16.07 56,13.31 Q4.2
N$43
  Top 0.254: R5.2 49.57,21.57 49.57,18.82 51.18,17.21 51.18,15.15 49.57,13.54 Q5.2
N$44
  Top 0.254: R6.2 43.38,21.57 44.52,21.57 46.13,19.97 47.74,19.97 50.72,16.98 50.72,16.29 49.11,14.69 44.52,14.69 43.38,13.54 Q6.2
N$45
  Bottom 0.254: U$3.9 42.69,27.08 44.98,27.08 47.28,24.79 56.92,24.79 58.06,23.64 58.06,20.88 59.9,19.05 72.29,19.05 74.82,16.52 R1.1
N$46  (via drill 0.61)
  Top 0.254: v53.24,49.57 53.7,50.03 53.7,55.31 53.24,55.77 44.98,55.77 42,58.75 42,60.59 41.08,61.51 37.64,61.51 36.03,59.9 35.57,59.9 U$4.15 | v66.1,44.98 66.1,41.54 v67.93,39.7 | v66.78,27.08 v66.78,34.2 | v61.28,20.43 61.28,17.44 62.19,16.52 R3.1
  Bottom 0.254: v53.24,49.57 55.31,49.57 56.92,47.97 58.29,47.97 60.13,46.13 64.95,46.13 v66.1,44.98 | v67.93,39.7 67.93,35.34 v66.78,34.2 | v66.78,27.08 66.78,24.1 67.24,23.64 67.24,22.72 64.95,20.43 v61.28,20.43
N$47  (via drill 0.61)
  Top 0.254: v28.92,28.69 v28.92,36.26 | v40.16,22.49 42.46,22.49 42.69,22.72 44.75,22.72 v46.59,20.88
  Bottom 0.254: v28.92,36.26 28.92,39.93 29.38,40.39 29.38,54.85 29.84,55.31 30.75,55.31 34.2,58.75 34.2,61.51 40.62,67.93 41.31,67.93 42,67.24 42,64.95 38.33,61.28 38.33,59.9 U$4.14 | v28.92,28.69 33.28,24.33 33.28,23.87 34.65,22.49 v40.16,22.49 | v46.59,20.88 47.28,20.88 48.65,19.51 54.16,19.51 55.77,17.9 55.77,16.52 R4.1
N$48  (via drill 0.61)
  Top 0.254: v36.72,55.77 40.62,59.67 U$4.13 | v30.75,29.61 v30.75,34.42 | v41.77,21.57 43.83,19.51 47.51,19.51 49.34,17.67 49.34,16.52 R5.1
  Bottom 0.254: v36.72,55.77 34.65,55.77 30.75,51.87 v30.75,34.42 | v30.75,29.61 32.82,27.54 32.82,26.62 34.2,25.25 38.78,25.25 41.77,22.26 v41.77,21.57
N$49  (via drill 0.61)
  Top 0.254: Q1.1 73.44,11.24 72.29,10.1 69.31,10.1 68.16,11.24 67.47,11.24 Q2.1 67.24,11.24 65.18,11.24 64.03,10.1 62.19,10.1 61.05,11.24 Q3.1 60.82,11.47 60.82,14.92 58.29,17.44 57.38,17.44 56.23,18.59 v53.7,18.59 | v47.05,18.59 43.38,18.59 41.08,20.88 32.36,20.88 20.43,32.82 6.43,32.82 R_LEG(BROWN).P5
  Bottom 0.254: v53.7,18.59 v47.05,18.59
N$50  (via drill 0.61)
  Top 0.254: v26.16,25.7 31.44,20.43 33.51,20.43 37.41,16.52 43.15,16.52 R6.1 | v22.72,51.18 22.72,58.29 26.16,61.74 30.52,61.74 31.21,61.05 32.13,61.05 33.05,61.97 41.31,61.97 43.38,59.9 U$4.12
  Bottom 0.254: v26.16,25.7 26.16,27.77 19.51,34.42 19.51,35.34 22.49,38.33 22.72,38.33 23.18,38.78 23.18,44.98 22.72,45.44 v22.72,51.18
N$51
  Top 0.254: AUDIO_IN.P3 12.85,5.28 12.85,12.39 20.66,20.2 MIC_IN.P1
N$52  (via drill 0.61)
  Top 0.254: v65.41,4.13 64.26,2.98 6.66,2.98 4.13,5.51 4.13,49.57 v5.51,50.95 | v7.11,52.56 12.62,58.06 12.62,58.98 14,60.36 U$21.6
  Bottom 0.254: v65.41,4.13 66.56,2.98 77.34,2.98 79.41,5.05 80.78,5.05 I2C_ADC.P4 | v7.11,52.56 v5.51,50.95
N$53
  Bottom 0.254: U$5.1 64.03,44.75 64.95,44.75 65.64,44.06 68.62,44.06 75.28,50.72 78.72,50.72 JP9.4 78.95,50.95 84.92,50.95 JP7.7
N$54
  Top 0.254: JP9.5 78.95,48.2 84.92,48.2 JP7.9
N$55  (via drill 0.61)
  Top 0.254: v21.8,25.02 6.43,25.02 L_LEG(GREEN).P2 | v24.33,25.25 25.25,25.25 32.36,18.13 35.11,18.13 41.77,11.47 Q6.1 42,11.24 43.15,10.1 44.98,10.1 46.13,11.24 48.2,11.24 Q5.1
  Bottom 0.254: v21.8,25.02 24.1,25.02 v24.33,25.25 | Q4.1 54.39,11.47 53.24,11.47 50.03,14.69 48.88,14.69 48.2,14 48.2,11.47 Q5.1
N$56  (via drill 0.61)
  Top 0.254: v16.75,14.92 16.75,12.62 22.03,7.34 30.06,7.34 32.13,5.28 36.49,5.28 v38.56,7.34 | v46.82,8.95 50.49,8.95 51.64,7.8 53.7,7.8 57.15,11.24 Q4.3
  Bottom 0.254: v16.75,14.92 8.95,22.72 6.43,22.72 L_LEG(GREEN).P3 | v38.56,7.34 45.21,7.34 v46.82,8.95
N$57  (via drill 0.61)
  Top 0.254: v40.16,29.38 37.87,29.38 36.26,30.98 34.2,30.98 33.28,31.9 33.28,37.41 30.29,40.39 30.06,40.39 25.93,44.52 25.02,44.52 19.51,39.02 6.43,39.02 R_LEG(BROWN).P2 | v57.83,18.36 58.75,18.36 v60.82,16.29
  Bottom 0.254: v40.16,29.38 40.16,27.54 45.44,22.26 47.28,22.26 49.11,20.43 55.77,20.43 v57.83,18.36 | v60.82,16.29 62.42,14.69 62.88,14.69 65.87,11.7 65.87,11.02 69.54,7.34 74.82,7.34 76.19,8.72 76.19,11.24 Q1.3
N$58
  Top 0.254: JP9.9 78.95,38.1 84.92,38.1 JP7.17
N$59
  Top 0.254: JP9.10 78.95,35.57 84.92,35.57 JP7.19
N$60
  Top 0.254: JP7.18 87.67,38.1 93.86,38.1 JP8.9
N$61  (via drill 0.61)
  Top 0.254: v19.97,58.75 22.49,58.75 29.15,65.41 v31.44,65.41 | v48.65,68.85 51.18,68.85 58.06,61.97 63.11,61.97 v63.34,61.74 | v71.37,49.8 71.37,49.34 77.34,43.38 77.34,31.9 78.72,30.52 JP9.12 78.95,30.52 84.92,30.52 JP7.23
  Bottom 0.254: v19.97,58.75 14.23,53.01 U$21.3 | v31.44,65.41 36.72,65.41 40.16,68.85 v48.65,68.85 | v63.34,61.74 64.72,60.36 64.72,55.31 67.24,52.78 67.24,50.95 68.39,49.8 v71.37,49.8
N$62
  Top 0.254: JP9.13 78.95,28 84.92,28 JP7.25
N$63
  Top 0.254: JP7.4 87.67,56 93.86,56 JP8.2
N$64  (via drill 0.61)
  Top 0.254: v20.43,34.88 18.59,36.72 6.43,36.72 R_LEG(BROWN).P3 | v31.9,22.95 39.24,22.95 39.7,23.41 48.42,23.41 v48.88,22.95
  Bottom 0.254: v20.43,34.88 20.43,34.42 v31.9,22.95 | v48.88,22.95 56,22.95 57.6,21.34 57.6,20.66 60.59,17.67 65.87,17.67 68.85,14.69 69.08,14.69 70,13.77 70,11.47 Q2.3
N$65
  Top 0.254: JP8.5 93.86,48.2 87.67,48.2 JP7.10
  Bottom 0.254: R8.2 85.6,10.79 86.06,10.79 90.88,15.61 90.88,44.98 87.67,48.2 JP7.10
N$66  (via drill 0.61)
  Top 0.254: v74.36,25.25 74.36,34.2 72.75,35.8 70.46,35.8 64.03,42.23 U$5.2 | JP8.6 93.86,45.67 87.67,45.67 JP7.12
  Bottom 0.254: v74.36,25.25 74.82,25.25 75.28,25.7 87.44,25.7 89.05,27.31 89.05,44.29 87.67,45.67 JP7.12
N$67
  Top 0.254: JP7.14 87.67,43.15 93.86,43.15 JP8.7
N$68
  Top 0.254: JP7.16 87.67,40.62 93.86,40.62 JP8.8
N$69  (via drill 0.61)
  other vias: 21.75,34.29
N$70
  Top 0.254: JP7.20 87.67,35.57 93.86,35.57 JP8.10
N$71  (via drill 0.61)
  Top 0.254: v76.19,32.13 76.19,28.46 78.03,26.62 94.55,26.62 95.47,27.54 95.47,31.44 94.09,32.82 JP8.11 93.86,33.05 87.67,33.05 JP7.22
  Bottom 0.254: v76.19,32.13 75.05,33.28 70.46,33.28 69.54,32.36 64.03,32.36 U$5.6
N$72
  Top 0.254: JP7.24 87.67,30.52 93.86,30.52 JP8.12
N$73
  Top 0.254: JP7.26 87.67,28 93.86,28 JP8.13
N$74
  Bottom 0.254: L_LEG(GREEN).P4 6.2,20.66 5.51,19.97 5.28,19.97 4.13,18.82 4.13,11.02 8.26,6.88 29.84,6.88 32.36,4.36 43.6,4.36 50.72,11.47 Q5.3
N$75
  Bottom 0.254: L_LEG(GREEN).P5 6.2,18.82 6.2,15.84 4.59,14.23 4.59,11.24 5.51,10.33 21.57,10.33 22.95,11.7 22.95,14 23.64,14.69 29.84,14.69 35.11,9.41 42.46,9.41 44.29,11.24 Q6.3
N$76  (via drill 0.61)
  Top 0.254: v53.01,10.56 53.01,17.9 50.72,20.2 50.72,22.49 49.34,23.87 35.11,23.87 34.65,23.41 32.82,23.41 v31.9,24.33 | v12.39,47.51 12.39,56.23 14,57.83 U$21.5
  Bottom 0.254: v53.01,10.56 52.56,10.56 51.18,9.18 51.18,8.26 51.64,7.8 52.1,7.8 57.38,2.52 80.33,2.52 81.93,4.13 81.93,4.36 82.62,5.05 I2C_ADC.P3 | v31.9,24.33 32.82,23.41 32.82,22.49 30.98,20.66 23.41,20.66 20.88,23.18 16.75,23.18 14.23,25.7 14.23,45.67 v12.39,47.51
N$77
  Top 0.254: AUDIO_IN.P4 10.79,5.28 10.79,12.16 18.82,20.2 MIC_IN.P2
N$78
  Top 0.254: R7.2 80.78,21.57 80.78,17.9 81.7,16.98 81.7,13.77 81.47,13.54 Q7.2
N$79
  Top 0.254: POWER_BUTTON.P1 6.2,49.11 5.51,48.42 5.28,48.42 4.59,47.74 4.59,32.36 11.02,25.93 22.26,25.93 30.52,17.67 34.65,17.67 40.62,11.7 40.62,10.79 43.38,8.03 50.72,8.03 51.41,7.34 72.06,7.34 73.9,9.18 80.33,9.18 82.39,11.24 Q7.3
N$80  (via drill 0.61)
  Top 0.254: v55.31,15.15 56,15.15 59.67,11.47 59.67,10.79 60.82,9.64 78.26,9.64 79.87,11.24 Q7.1
  Bottom 0.254: v55.31,15.15 48.42,15.15 44.52,19.05 24.33,19.05 21.34,22.03 17.21,22.03 13.77,25.47 13.77,36.95 6.43,44.29 6.43,47.28 POWER_BUTTON.P2
N$81  (via drill 0.61)
  Top 0.254: v56.69,49.57 56.69,53.7 53.7,56.69 48.88,56.69 45.9,59.67 U$4.11 | v65.87,46.59 67.93,44.52 67.93,41.31 70.69,38.56 72.52,38.56 75.28,35.8 75.28,24.79 v75.5,24.56
  Bottom 0.254: v56.69,49.57 57.38,49.57 60.36,46.59 v65.87,46.59 | v75.5,24.56 75.5,22.49 80.56,17.44 80.56,16.52 R7.1
N$83
  Bottom 0.254: CHARGE_IN.P1 6.43,14 17.9,14 19.05,15.15 32.82,15.15 J1.PWR
N$84  (via drill 0.61)
  Top 0.254: v36.95,67.01 39.7,64.26 43.38,64.26 47.74,59.9 48.2,59.9 U$4.10 | v30.75,67.01 28.92,67.01 28,67.93 20.2,67.93 v19.51,67.24 | v20.88,16.07 24.1,12.85 FQP30N06L.1
  Bottom 0.254: v30.75,67.01 v36.95,67.01 | v19.51,67.24 17.21,67.24 16.52,67.93 12.85,67.93 7.8,62.88 5.74,62.88 4.13,61.28 4.13,24.79 5.05,23.87 8.49,23.87 16.29,16.07 v20.88,16.07
N$85
  Top 0.254: AUDIO_IN.P2 14.92,5.28 15.61,5.97 15.61,6.2 16.29,6.88 22.26,6.88 23.87,5.28 AUDIO_OUT.P1
N$86
  Top 0.254: AUDIO_IN.P1 16.75,5.28 21.8,5.28 AUDIO_OUT.P2
N$87
  Bottom 0.254: U$1.6 49.57,32.36 52.78,32.36 55.31,34.88 55.31,35.11 56.46,36.26 58.29,36.26 63.34,41.31 67.47,41.31 68.39,42.23 71.6,42.23 U$5.15
N$88
  Top 0.254: U$2.6 68.39,51.87 68.39,42.69 71.14,39.93 71.6,39.93 U$5.14
N$89  (via drill 0.61)
  Top 0.254: v46.13,33.51 41.54,33.51 40.62,32.59 35.11,32.59 U$3.6 | v65.64,33.51 v52.56,33.51
  Bottom 0.254: v52.56,33.51 v46.13,33.51 | v65.64,33.51 66.1,33.51 66.33,33.28 67.7,33.28 71.6,37.18 U$5.13
N$90
  Top 0.254: R_LEG(BROWN).P4 6.43,34.65 19.28,34.65 28.69,25.25 38.78,25.25 39.24,24.79 53.47,24.79 54.85,23.41 54.85,21.11 55.54,20.43 59.44,20.43 61.74,22.72 64.03,22.72 69.77,16.98 69.77,16.29 68.16,14.69 66.78,14.69 63.57,11.47 Q3.3
N$91
  Top 0.254: U$5.12 71.6,34.88 67.47,34.88 66.1,36.26 60.36,36.26 57.83,38.78 56,38.78 53.24,41.54 53.24,44.52 45.9,51.87 U$4.6
N$92
  Bottom 0.254: 92.49,49.34 92.49,27.54 94.33,25.7 94.33,20.2 R9.2 | 92.49,49.34 93.86,50.72 JP8.4 | 92.49,49.34 91.11,50.72 87.67,50.72 JP7.8
N$93
  Top 0.254: AUDIO_IN.P5 8.72,5.28 8.72,11.24 16.75,19.28 16.75,20.2 MIC_IN.P3
N$94
  Top 0.254: AUDIO_IN.P6 6.66,5.28 6.66,9.87 14.69,17.9 14.69,20.2 MIC_IN.P4
N$95
  Bottom 0.254: LED.P2 6.43,58.52 6.88,58.52 10.33,61.97 18.13,61.97 26.62,53.47 26.62,53.01 U$21.9
N$96  (via drill 0.61)
  Top 0.254: v14,62.88 7.8,56.69 6.43,56.69 LED.P3
  Bottom 0.254: v14,62.88 19.28,62.88 26.62,55.54 U$21.10
N$97
  Top 0.254: UART/GND.P2 95.01,7.8 93.41,7.8 90.65,10.56 R8.1
N$98
  Top 0.254: UART/GND.P1 95.01,9.87 95.01,14.46 94.55,14.92 R9.1
N$99
  Bottom 0.254: CHARGE_IN.P2 6.43,11.7 17.67,11.7 18.59,10.79 19.74,10.79 21.57,12.62 FQP30N06L.2
N$100  (via drill 0.61)
  Top 0.254: v23.64,45.9 14.23,55.31 U$21.4 | v45.9,31.21 v37.41,31.21 | JP7.21 84.92,33.05 78.95,33.05 JP9.11
  Bottom 0.254: v23.64,45.9 23.64,40.16 32.59,31.21 v37.41,31.21 | v45.9,31.21 77.11,31.21 78.72,32.82 JP9.11
N$101  (via drill 0.61)
  Top 0.254: v52.78,54.85 35.57,54.85 31.9,58.52 31.9,59.21 30.75,60.36 26.85,60.36 U$21.12 | v61.28,54.85 61.74,54.85 62.88,56 71.83,56 74.82,58.98 v74.82,59.67
  Bottom 0.254: v61.28,54.85 v52.78,54.85 | v74.82,59.67 74.82,57.38 78.72,53.47 JP9.3 78.95,53.47 84.92,53.47 JP7.5
N$103  (via drill 0.61)
  Top 0.254: v30.29,54.39 26.85,57.83 U$21.11 | v29.84,39.47 29.84,38.78 32.82,35.8 32.82,27.31 34.42,25.7 39.02,25.7 39.47,25.25 53.7,25.25 57.6,21.34 v58.98,21.34 | v81.7,47.28 v81.7,44.06 | v81.7,49.11 81.7,50.26 83.77,52.33 83.77,54.62 | 83.77,54.62 84.92,55.77 JP7.3 | 83.77,54.62 82.62,55.77 78.95,55.77 JP9.2
  Bottom 0.254: v30.29,54.39 30.29,39.93 v29.84,39.47 | v58.98,21.34 60.82,19.51 64.95,19.51 71.6,26.16 79.64,26.16 81.7,28.23 v81.7,44.06 | v81.7,49.11 v81.7,47.28
V_IN+
  Top 0.254: FQP30N06L.3 19.28,12.62 23.87,8.03 32.82,8.03 J1.GND

### Text on the board
tPlace: ELFKIN TEST PCB / REV B / EJW/RKS | GDS
tSilk: R LEG (BROWN)